# Altium schematic sheet FX_MQTT.SchDoc: FX2.00
size A3; Date: 2018.11.12; Engineer: 淹死的鱼; Address1: STM32F405RGT6; Address2: V2.0; Address3: 000; Address4: 4; DocumentNumber: A3; Application_BuildNumber: 5
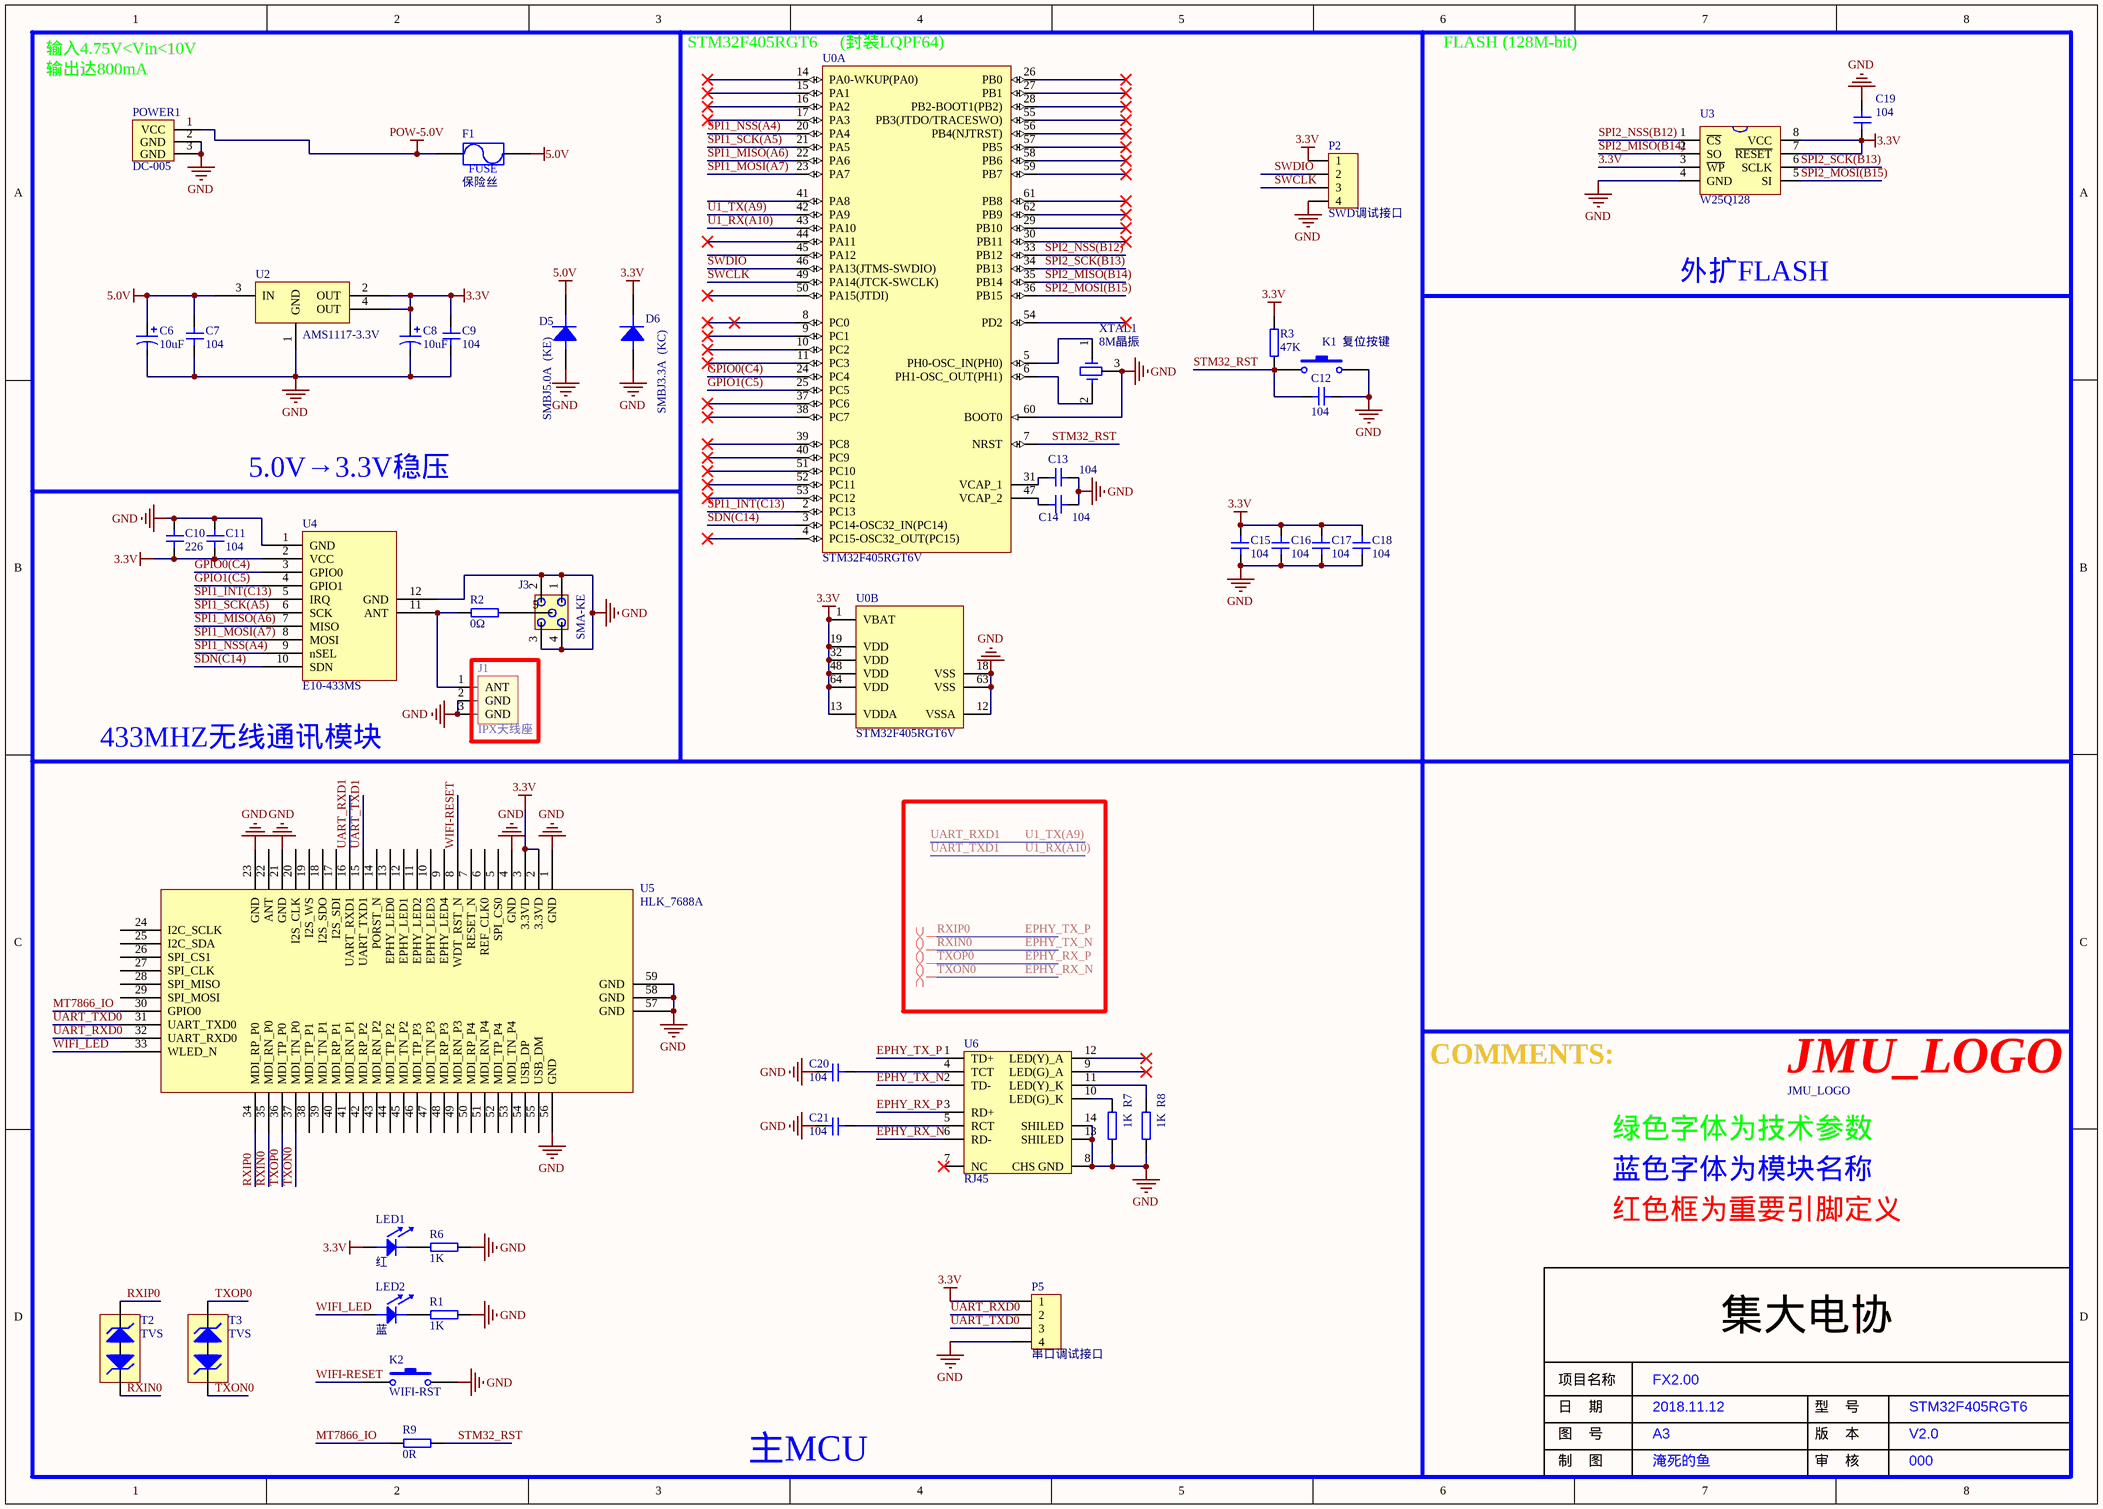
[diagram p0: FX_MQTT.SchDoc]

## Parts
?  JMU_LOGO  [JMU_LOGO(1.35cm)]
C6  10uF  [TAJ-A]
C7  104  [0805C]
C8  10uF  [TAJ-A]
C9  104  [0805C]
C10  226  [0805C]
C11  104  [0805C]
C12  104  [0805C]
C13  104  [0805C]
C14  104  [0805C]
C15  104  [0805C]
C16  104  [0805C]
C17  104  [0805C]
C18  104  [0805C]
C19  104  [0805C]
C20  104  [0805C]
C21  104  [0805C]
D5  SMBJ5.0A  (KE)  [SMBJ]
D6  SMBJ3.3A  (KC)  [SMBJ]
F1  保险丝  [1812]
J1  IPX天线座  [IPX天线底座]
J3  SMA-KE  [SMA-KE]
K1  复位按键  [贴片按键]
K2  WIFI-RST  [卧式侧按键 4.5*4.5*6]
LED1  红  [LED-RED直插)]
LED2  蓝  [LED-BLUE(直插)]
P2  SWD调试接口  [Header 4]
P5  串口调试接口  [Header 4]
POWER1  DC-005  [DC-005]
R1  1K  [0805R]
R2  0Ω  [0805R]
R3  47K  [0805R]
R6  1K  [0805R]
R7  1K  [0805R]
R8  1K  [0805R]
R9  0R  [0805R]
T2  TVS  [TVS]
T3  TVS  [TVS]
U0  STM32F405RGT6V  [LQFP-64(GOOD)]  (parts A,B of 2)
U2  AMS1117-3.3V  [SOT-223]
U3  W25Q128  [SOW-8]
U4  E10-433MS  [E10-433MS]
U5  HLK_7688A  [MT7688]
U6  RJ45  [RJ45]
XTAL1  8M晶振  [三脚贴片8M晶振]

## Nets
3.3V: C8.1 C9.2 C10.1 C11.1 C15.1 C16.1 C17.1 C18.1 C19.1 D6.2 LED1.1 P2.1 P5.1 R3.2 U0.1(VBAT) U0.13(VDDA) U0.19(VDD) U0.32(VDD) U0.48(VDD) U0.64(VDD) U2.2(OUT) U2.4(OUT) U3.3(~{WP}) U3.7(~{RESET}) U3.8(VCC) U4.2(VCC) U5.2(3.3VD) U5.3(3.3VD)
5.0V: C6.1 C7.2 D5.2 F1.2 U2.3(IN)
GND: C6.2 C7.1 C8.2 C9.1 C10.2 C11.2 C12.1 C13.1 C14.1 C15.2 C16.2 C17.2 C18.2 C19.2 C20.1 C21.1 D5.1 D6.1 J1.2(GND) J1.3(GND) J3.1 J3.2 J3.3 J3.4 K1.2 K2.2 P2.4 P5.4 POWER1.2(GND) POWER1.3(GND) R1.2 R6.2 R7.1 R8.1 U0.12(VSSA) U0.18(VSS) U0.60(BOOT0) U0.63(VSS) U2.1(GND) U3.4(GND) U4.1(GND) U4.12(GND) U5.1(GND) U5.4(GND) U5.21(GND) U5.23(GND) U5.56(GND) U5.57(GND) U5.58(GND) U5.59(GND) U6.8(CHS_GND) U6.13(SHILED) U6.14(SHILED) XTAL1.3
POW-5.0V: F1.1 POWER1.1(VCC)
EPHY_RX_N: T3.1(A) U5.37(MDI_TN_P0) U6.6(RD-)  [also labelled TXON0]
EPHY_RX_P: T3.2(K) U5.36(MDI_TP_P0) U6.3(RD+)  [also labelled TXOP0]
EPHY_TX_N: T2.1(A) U5.35(MDI_RN_P0) U6.2(TD-)  [also labelled RXIN0]
EPHY_TX_P: T2.2(K) U5.34(MDI_RP_P0) U6.1(TD+)  [also labelled RXIP0]
GPIO0(C4): U0.24(PC4) U4.3(GPIO0)
GPIO1(C5): U0.25(PC5) U4.4(GPIO1)
MT7866_IO: R9.1 U5.30(GPIO0)
SDN(C14): U0.3(PC14-OSC32_IN(PC14)) U4.10(SDN)
SPI1_INT(C13): U0.2(PC13) U4.5(IRQ)
SPI1_MISO(A6): U0.22(PA6) U4.7(MISO)
SPI1_MOSI(A7): U0.23(PA7) U4.8(MOSI)
SPI1_NSS(A4): U0.20(PA4) U4.9(nSEL)
SPI1_SCK(A5): U0.21(PA5) U4.6(SCK)
SPI2_MISO(B14): U0.35(PB14) U3.2(SO)
SPI2_MOSI(B15): U0.36(PB15) U3.5(SI)
SPI2_NSS(B12): U0.33(PB12) U3.1(~{CS})
SPI2_SCK(B13): U0.34(PB13) U3.6(SCLK)
STM32_RST: C12.2 K1.1 R3.1 R9.2 U0.7(NRST)
SWCLK: P2.3 U0.49(PA14(JTCK-SWCLK))
SWDIO: P2.2 U0.46(PA13(JTMS-SWDIO))
U1_RX(A10): U0.43(PA10) U5.15(UART_TXD1)  [also labelled UART_TXD1]
U1_TX(A9): U0.42(PA9) U5.16(UART_RXD1)  [also labelled UART_RXD1]
UART_RXD0: P5.2 U5.32(UART_RXD0)
UART_TXD0: P5.3 U5.31(UART_TXD0)
WIFI-RESET: K2.1 U5.8(WDT_RST_N)
WIFI_LED: LED2.1 U5.33(WLED_N)
NetC13_2: C13.2 U0.31(VCAP_1)
NetC14_2: C14.2 U0.47(VCAP_2)
NetC20_2: C20.2 U6.4(TCT)
NetC21_2: C21.2 U6.5(RCT)
NetJ1_1: J1.1(ANT) R2.1 U4.11(ANT)
NetJ3_5: J3.5 R2.2
NetLED1_2: LED1.2 R6.1
NetLED2_2: LED2.2 R1.1
NetR7_2: R7.2 U6.10(LED(G)_K)
NetR8_2: R8.2 U6.11(LED(Y)_K)
NetU0_5: U0.5(PH0-OSC_IN(PH0)) XTAL1.1
NetU0_6: U0.6(PH1-OSC_OUT(PH1)) XTAL1.2

Not connected (* = marked no-connect by the designer): U0 4(PC15-OSC32_OUT(PC15))* 8(PC0)* 9(PC1)* 10(PC2)* 11(PC3)* 14(PA0-WKUP(PA0))* 15(PA1)* 16(PA2)* 17(PA3)* 26(PB0)* 27(PB1)* 28(PB2-BOOT1(PB2))* 29(PB10)* 30(PB11)* 37(PC6)* 38(PC7)* 39(PC8)* 40(PC9)* 41(PA8) 44(PA11)* 45(PA12) 50(PA15(JTDI))* 51(PC10)* 52(PC11)* 53(PC12)* 54(PD2)* 55(PB3(JTDO/TRACESWO))* 56(PB4(NJTRST))* 57(PB5)* 58(PB6)* 59(PB7)* 61(PB8)* 62(PB9)*; U5 5(SPI_CS0) 6(REF_CLK0) 7(RESET_N) 9(EPHY_LED4) 10(EPHY_LED3) 11(EPHY_LED2) 12(EPHY_LED1) 13(EPHY_LED0) 14(PORST_N) 17(I2S_SDI) 18(I2S_SDO) 19(I2S_WS) 20(I2S_CLK) 22(ANT) 24(I2C_SCLK) 25(I2C_SDA) 26(SPI_CS1) 27(SPI_CLK) 28(SPI_MISO) 29(SPI_MOSI) 38(MDI_TP_P1) 39(MDI_TN_P1) 40(MDI_RP_P1) 41(MDI_RN_P1) 42(MDI_RP_P2) 43(MDI_RN_P2) 44(MDI_TP_P2) 45(MDI_TN_P2) 46(MDI_TP_P3) 47(MDI_TN_P3) 48(MDI_RP_P3) 49(MDI_RN_P3) 50(MDI_RP_P4) 51(MDI_RN_P4) 52(MDI_TP_P4) 53(MDI_TN_P4) 54(USB_DP) 55(USB_DM); U6 7(NC)* 9(LED(G)_A)* 12(LED(Y)_A)*

## Layout directives
differential pair: EPHY_RX_N, EPHY_RX_P, EPHY_TX_N, EPHY_TX_P

## Notes on the sheet
- (near U0) STM32F405RGT6     (封装LQPF64)
- FLASH (128M-bit)
- 输入4.75V<Vin<10V
- 输出达800mA
- 外扩FLASH
- 5.0V→3.3V稳压
- 433MHZ无线通讯模块
- COMMENTS:
- 绿色字体为技术参数
- 蓝色字体为模块名称
- 红色框为重要引脚定义
- 主MCU
- 集大电协
- 项目名称
- 日    期
- 图    号
- 版    本
- 型    号
- 制    图
- 审    核
- (in symbol Fuse) FUSE

## Library data of the parts
? = JMU_LOGO: LOGO
C6 C8 = Pol Cap: 极性贴片电容
C7 C9-C21 = Cap1: 无极贴片电容
D5 D6 = Diode: 二极管
F1 = Fuse
J3 = SMA-KE: SMA天线底座
K1 = 贴片按键: 轻触开关
K2 = 轻触按键: 轻触开关
LED1 LED2 = LED: 发光二极管
P2 P5 = Header 4: 排针
POWER1 = DC-005: 电源插孔
R1-R3 R6-R9 = Res: 电阻
U0 = STM32F405RGT6V: ARM Cortex-M4 32-bit MCU+FPU, 210 DMIPS, 1024 kB Flash, 192 kB Internal RAM, 51 I/Os, 64-pin LQFP, -40 to 85 degC, Tray; Manufacturer: STMicroelectronics; D/A Converter: 2x12-bit; FLASH Size (Prog) (kB): 1024; I/Os (High Current): 51; Internal RAM Size (kB): 192; Operating Frequency(F) (Processor speed) (MHz): 168; Supply Voltage(Vcc) max (V): 3.6; Supply Voltage(Vcc) min (V): 1.8; DatasheetVersion: Rev. 4; PackageVersion: Rev. 4, 06/2013; PackageReference: LQFP64; PackageDescription: 64-Pin Low Profile Quad Flat Package, 10 x 10 mm Body, 0.5 mm Pitch; Supplier 1: Digi-Key; Supplier Part Number 1: STM32F405RGT6V-ND; Supplier 2: Farnell; Supplier Part Number 2: 2333282; Supplier 3: Newark; Supplier Part Number 3: 99W9900; Supplier 4: Newark; Supplier Part Number 4: 66W7297; Supplier 5: Mouser; Supplier Part Number 5: 511-STM32F405RGT6V; Core: ARM Cortex-M4; Packing: Tray; Mounting Technology: Surface Mount; PartNumber: STM32F405RGT6V; ComponentLink1Description: Manufacturer URL; ComponentLink1URL: http://www.st.com/web/en/home.html; ComponentLink2Description: Datasheet; ComponentLink2URL: http://www.st.com/st-web-ui/static/active/en/resource/technical/document/datasheet/DM00037051.pdf; ComponentLink3Description: Package Specification; ComponentLink3URL: http://www.st.com/st-web-ui/static/active/en/resource/technical/document/datasheet/DM00037051.pdf
U2 = AMS1117-3.3V/5.0V: 电源芯片
U3 = W25Q128: FLASH芯片
U4 = E10-433MS: E10-433MS通信模块
XTAL1 = XTAL三脚贴片晶振: CSTCC8M00G53-RO 8.000M